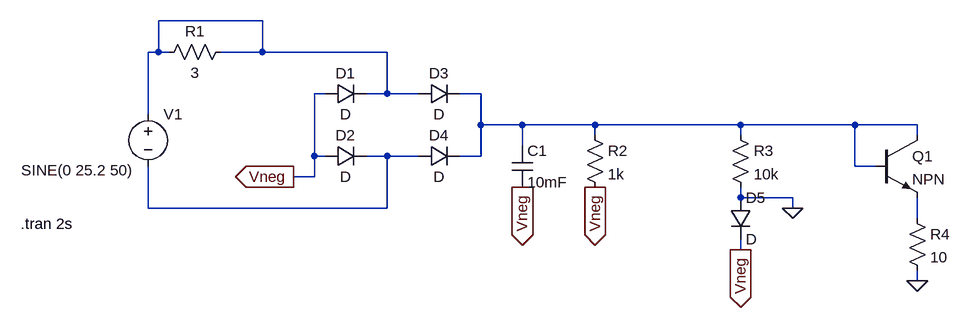
[diagram p0: schematic negative700mV.asc]
negative700mV.asc, the LTspice schematic file:
Version 4
SHEET 1 1240 680
WIRE 176 16 16 16
WIRE 16 64 16 16
WIRE 16 64 0 64
WIRE 32 64 16 64
WIRE 176 64 176 16
WIRE 176 64 112 64
WIRE 368 64 176 64
WIRE 272 128 256 128
WIRE 368 128 368 64
WIRE 368 128 336 128
WIRE 416 128 368 128
WIRE 512 128 480 128
WIRE 0 160 0 64
WIRE 512 176 512 128
WIRE 576 176 512 176
WIRE 688 176 576 176
WIRE 912 176 688 176
WIRE 1088 176 912 176
WIRE 1184 176 1088 176
WIRE 688 192 688 176
WIRE 912 192 912 176
WIRE 1184 192 1184 176
WIRE 576 208 576 176
WIRE 256 224 256 128
WIRE 272 224 256 224
WIRE 368 224 336 224
WIRE 416 224 368 224
WIRE 512 224 512 176
WIRE 512 224 480 224
WIRE 1088 240 1088 176
WIRE 1120 240 1088 240
WIRE 256 256 256 224
WIRE 256 256 224 256
WIRE 912 288 912 272
WIRE 992 288 912 288
WIRE 0 304 0 240
WIRE 368 304 368 224
WIRE 368 304 0 304
WIRE 992 304 992 288
WIRE 1184 320 1184 288
WIRE 912 368 912 352
WIRE 1184 416 1184 400
FLAG 224 256 Vneg
IOPIN 224 256 Out
FLAG 576 272 Vneg
IOPIN 576 272 Out
FLAG 912 368 Vneg
IOPIN 912 368 Out
FLAG 688 272 Vneg
IOPIN 688 272 Out
FLAG 992 304 0
FLAG 1184 416 0
SYMBOL voltage 0 144 R0
WINDOW 3 -195 102 Left 2
WINDOW 123 0 0 Left 2
WINDOW 39 0 0 Left 2
SYMATTR InstName V1
SYMATTR Value SINE(0 25.2 50)
SYMBOL diode 272 144 R270
WINDOW 0 32 32 VTop 2
WINDOW 3 0 32 VBottom 2
SYMATTR InstName D1
SYMBOL diode 272 240 R270
WINDOW 0 32 32 VTop 2
WINDOW 3 0 32 VBottom 2
SYMATTR InstName D2
SYMBOL diode 416 144 R270
WINDOW 0 32 32 VTop 2
WINDOW 3 0 32 VBottom 2
SYMATTR InstName D3
SYMBOL diode 416 240 R270
WINDOW 0 32 32 VTop 2
WINDOW 3 0 32 VBottom 2
SYMATTR InstName D4
SYMBOL cap 560 208 R0
SYMATTR InstName C1
SYMATTR Value 10mF
SYMBOL res 128 48 R90
WINDOW 0 0 56 VBottom 2
WINDOW 3 32 56 VTop 2
SYMATTR InstName R1
SYMATTR Value 3
SYMBOL res 672 176 R0
SYMATTR InstName R2
SYMATTR Value 1k
SYMBOL diode 896 288 R0
SYMATTR InstName D5
SYMBOL res 896 176 R0
SYMATTR InstName R3
SYMATTR Value 10k
SYMBOL npn 1120 192 R0
SYMATTR InstName Q1
SYMBOL res 1168 304 R0
SYMATTR InstName R4
SYMATTR Value 10
TEXT -196 328 Left 2 !.tran 2s

The netlist it stands for:
* negative700mV.asc
V1 N001 N003 SINE(0 25.2 50)
D1 Vneg N001 D
D2 Vneg N003 D
D3 N001 N002 D
D4 N003 N002 D
C1 N002 Vneg 10mF
R1 N001 N001 3
R2 N002 Vneg 1k
D5 0 Vneg D
R3 N002 0 10k
Q1 N002 N002 N004 0 NPN
R4 N004 0 10
.model D D
.lib standard.dio
.model NPN NPN
.model PNP PNP
.lib standard.bjt
.tran 2s
.backanno
.end